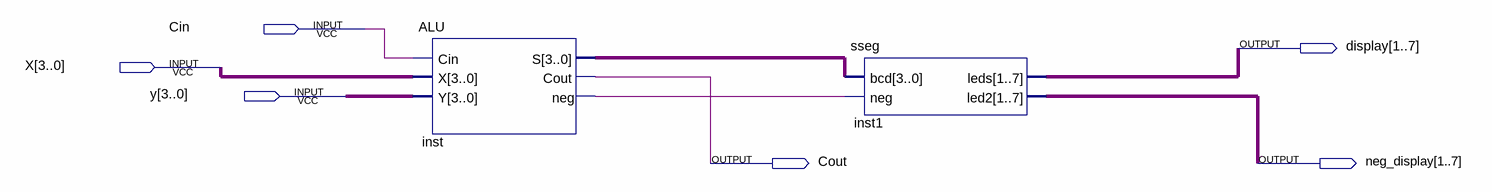
[diagram p0: schematic sheet]
// Quartus schematic CombinedASU1.bdf as structural Verilog: 2 symbols, 6 pins
module CombinedASU1 (
  input  Cin,
  input  [3:0] X,
  input  [3:0] y,
  output [1:7] display,
  output Cout,
  output [1:7] neg_display
);

  wire inst_neg;
  wire [3:0] inst_s;

  ALU inst (.Cin(Cin), .X(X), .Y(y), .S(inst_s), .Cout(Cout), .neg(inst_neg));
  sseg inst1 (.bcd(inst_s), .neg(inst_neg), .leds(display), .led2(neg_display));
endmodule
